# Altium schematic sheet bms_v2.SchDoc
size A4; SheetNumber: 1; SheetTotal: 1
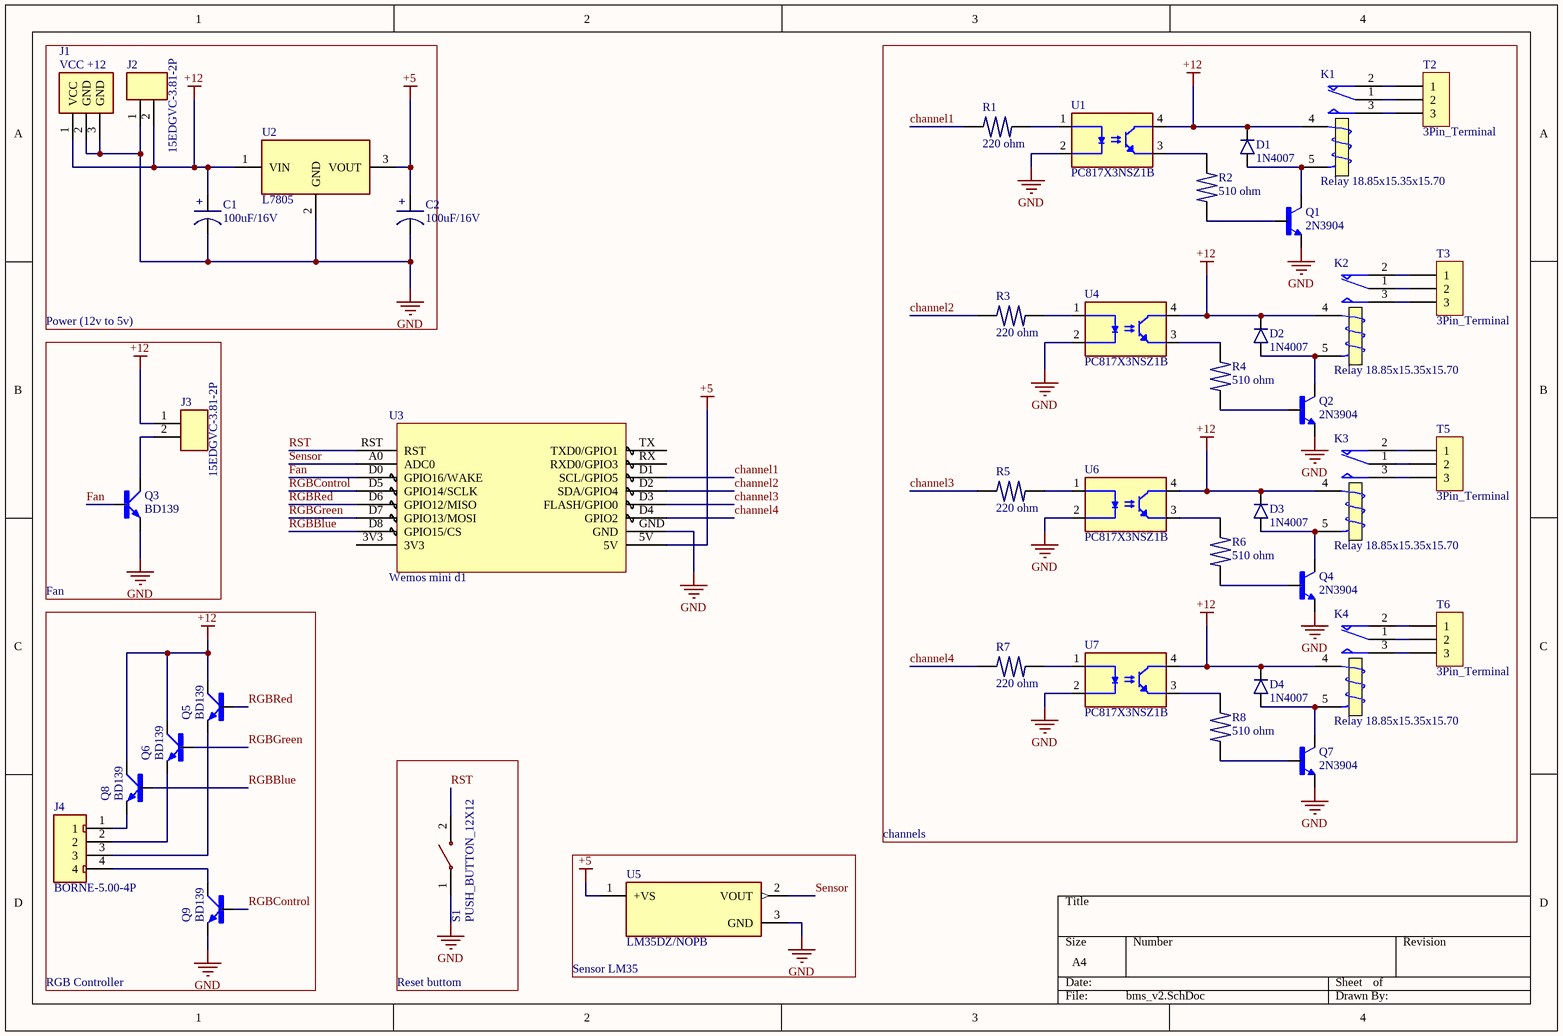
[diagram p0: bms_v2.SchDoc]

## Parts
C1  100uF/16V  [100uF/16V]
C2  100uF/16V  [100uF/16V]
D1  1N4007  [1N4007]
D2  1N4007  [1N4007]
D3  1N4007  [1N4007]
D4  1N4007  [1N4007]
J1  VCC +12  [JACK_P4]
J2  15EDGVC-3.81-2P  [15EDGVC-3.81-2P]
J3  15EDGVC-3.81-2P  [15EDGVC-3.81-2P]
J4  BORNE-5.00-4P  [BORNE-5.00-4P]
K1  Relay 18.85x15.35x15.70  [Relay 18.85x15.35x15.70]
K2  Relay 18.85x15.35x15.70  [Relay 18.85x15.35x15.70]
K3  Relay 18.85x15.35x15.70  [Relay 18.85x15.35x15.70]
K4  Relay 18.85x15.35x15.70  [Relay 18.85x15.35x15.70]
Q1  2N3904  [TO92127P495H495-3]
Q2  2N3904  [TO92127P495H495-3]
Q3  BD139  [TO126AV]
Q4  2N3904  [TO92127P495H495-3]
Q5  BD139  [TO126AV]
Q6  BD139  [TO126AV]
Q7  2N3904  [TO92127P495H495-3]
Q8  BD139  [TO126AV]
Q9  BD139  [TO126AV]
R1  220 ohm  [RESISTOR_PTH_10mm]
R2  510 ohm  [RESISTOR_PTH_10mm]
R3  220 ohm  [RESISTOR_PTH_10mm]
R4  510 ohm  [RESISTOR_PTH_10mm]
R5  220 ohm  [RESISTOR_PTH_10mm]
R6  510 ohm  [RESISTOR_PTH_10mm]
R7  220 ohm  [RESISTOR_PTH_10mm]
R8  510 ohm  [RESISTOR_PTH_10mm]
S1  PUSH_BUTTON_12X12  [PUSH_BUTTON_12X12_BLUE]
T2  3Pin_Terminal  [3Pin_Terminal]
T3  3Pin_Terminal  [3Pin_Terminal]
T5  3Pin_Terminal  [3Pin_Terminal]
T6  3Pin_Terminal  [3Pin_Terminal]
U1  PC817X3NSZ1B  [DIP762W50P254L495H455Q4]
U2  L7805  [L7805_180]
U3  Wemos mini d1  [PCBComponent_1]
U4  PC817X3NSZ1B  [DIP762W50P254L495H455Q4]
U5  LM35DZ/NOPB  [TO92127P521H735-3]
U6  PC817X3NSZ1B  [DIP762W50P254L495H455Q4]
U7  PC817X3NSZ1B  [DIP762W50P254L495H455Q4]

## Blocks framed on the sheet
Power (12v to 5v): C1 C2 J1 J2 U2
channels: D1-D4 K1-K4 Q1 Q2 Q4 Q7 R1-R8 T2 T3 T5 T6 U1 U4 U6 U7
Reset buttom: S1
Sensor LM35: U5

## Nets
+5: C2.2 U2.3(VOUT) U3.5V U5.1(+VS)
+12: C1.2 D1.2 D2.2 D3.2 D4.2 J1.1(VCC) J2.2 J3.1 K1.4(T1) K2.4(T1) K3.4(T1) K4.4(T1) Q5.C Q6.C Q8.C U1.4(COLLECTOR) U2.1(VIN) U4.4(COLLECTOR) U6.4(COLLECTOR) U7.4(COLLECTOR)
GND: C1.1 C2.1 J1.2(GND) J1.3(GND) J2.1 Q1.1(E) Q2.1(E) Q3.E Q4.1(E) Q7.1(E) Q9.E S1.1 U1.2(CATHODE) U2.2(GND) U3.GND U4.2(CATHODE) U5.3(GND) U6.2(CATHODE) U7.2(CATHODE)
channel1: R1.1 U3.D1(SCL/GPIO5)
channel2: R3.1 U3.D2(SDA/GPIO4)
channel3: R5.1 U3.D3(FLASH/GPIO0)
channel4: R7.1 U3.D4(GPIO2)
Fan: Q3.B U3.D0(GPIO16/WAKE)
RGBBlue: Q8.B U3.D8(GPIO15/CS)
RGBControl: Q9.B U3.D5(GPIO14/SCLK)
RGBGreen: Q6.B U3.D7(GPIO13/MOSI)
RGBRed: Q5.B U3.D6(GPIO12/MISO)
RST: S1.2 U3.RST
Sensor: U3.A0(ADC0) U5.2(VOUT)
NetD1_1: D1.1 K1.5(T2) Q1.3(C)
NetD2_1: D2.1 K2.5(T2) Q2.3(C)
NetD3_1: D3.1 K3.5(T2) Q4.3(C)
NetD4_1: D4.1 K4.5(T2) Q7.3(C)
NetJ3_2: J3.2 Q3.C
NetJ4_1: J4.1 Q8.E
NetJ4_2: J4.2 Q6.E
NetJ4_3: J4.3 Q5.E
NetJ4_4: J4.4 Q9.C
NetK1_1: K1.1(COM) T2.2
NetK1_2: K1.2(NC) T2.1
NetK1_3: K1.3(NO) T2.3
NetK2_1: K2.1(COM) T3.2
NetK2_2: K2.2(NC) T3.1
NetK2_3: K2.3(NO) T3.3
NetK3_1: K3.1(COM) T5.2
NetK3_2: K3.2(NC) T5.1
NetK3_3: K3.3(NO) T5.3
NetK4_1: K4.1(COM) T6.2
NetK4_2: K4.2(NC) T6.1
NetK4_3: K4.3(NO) T6.3
NetQ1_2: Q1.2(B) R2.2
NetQ2_2: Q2.2(B) R4.2
NetQ4_2: Q4.2(B) R6.2
NetQ7_2: Q7.2(B) R8.2
NetR1_2: R1.2 U1.1(ANODE)
NetR2_1: R2.1 U1.3(EMITTER)
NetR3_2: R3.2 U4.1(ANODE)
NetR4_1: R4.1 U4.3(EMITTER)
NetR5_2: R5.2 U6.1(ANODE)
NetR6_1: R6.1 U6.3(EMITTER)
NetR7_2: R7.2 U7.1(ANODE)
NetR8_1: R8.1 U7.3(EMITTER)

Not connected (* = marked no-connect by the designer): U3 3V3 RX(RXD0/GPIO3) TX(TXD0/GPIO1)

## Notes on the sheet
- Fan
- RGB Controller
- (in symbol 100uF/16V) +

## Library data of the parts
C1 C2 = 100uF/16V: Electrolytic Capacitor 100uF/16V
D1-D4 = 1N4007: Rectifier Diode 1000V 1A DO-41; Mouser PN: 637-1N4007; ComponentLink1Description: Datasheet; ComponentLink1URL: https://www.mouser.com/datasheet/2/849/1n4001-2577232.pdf; Digikey PN: 4617-1N4007TB-ND; JLCPCB PN: C3033995
J1 = JACK_P4: 9V Battery Connector Jack P4.
J2 J3 = 15EDGVC-3.81-2P: Female Connector 15EDGVC-2P, pitch 3.81mm.; JLCPCB PN: C8396
J4 = BORNE-5.00-4P: Borne 4 Vias, Pitch 5mm.; JLCPCB PN: C2915641
Q1 Q2 Q4 Q7 = 2N3904: TRANS NPN 40V 200MA TO92-3; MF: Rectron; SnapEDA_Link: https://www.snapeda.com/parts/2N3904/Rectron/view-part/?ref=snap; Package: TO-226-3 Rectron; MP: 2N3904; Check_prices: https://www.snapeda.com/parts/2N3904/Rectron/view-part/?ref=eda; Purchase-URL: https://pricing.snapeda.com/search/part/2N3904/?ref=eda; Price: None; Value: *; Availability: In Stock
Q3 Q5 Q6 Q8 Q9 = BD139: Bipolar (BJT) Transistor NPN 80 V 1.5 A - 1.25 W Through Hole TO-126-3; MF: ON; SnapEDA_Link: https://www.snapeda.com/parts/BD139/Onsemi/view-part/?ref=snap; Package: TO-126 STMicroelectronics; Value: *; MP: BD139; Check_prices: https://www.snapeda.com/parts/BD139/Onsemi/view-part/?ref=eda
R1-R8 = RESISTOR_10mm: Generic Resistor 10mm.
S1 = PUSH_BUTTON_12X12: Push Button Tactile Switch PTH 4 Pins 12x12mm.; Mouser PN: 992-BUTT-12-5; JLCPCB PN: C84931
U1 U4 U6 U7 = PC817X3NSZ1B: Optoisolator Transistor Output - 1 Channel 4-DIP; MF: Sharp Microelectronics; SnapEDA_Link: https://www.snapeda.com/parts/PC817X3NSZ1B/Sharp+Microelectronics/view-part/?ref=snap; Price: None; Purchase-URL: https://pricing.snapeda.com/search/part/PC817X3NSZ1B/?ref=eda; Check_prices: https://www.snapeda.com/parts/PC817X3NSZ1B/Sharp+Microelectronics/view-part/?ref=eda; MP: PC817X3NSZ1B; Value: *; Availability: In Stock; Package: DIP-4 Sharp Microelectronics
U2 = L7805: IC REG LINEAR 5V 1.5A TO220AB; ComponentLink1Description: Datasheet; ComponentLink1URL: https://www.mouser.com/datasheet/2/389/l78-1849632.pdf; Mouser PN: 511-L7805CV; Digikey PN: 497-1443-5-ND; JLCPCB PN PTH: C347289; JLCPCB PN SMD: C15077
U5 = LM35DZ/NOPB: Temperature Sensor Analog, Local 0Â°C ~ 100Â°C 10mV/Â°C TO-92-3; MP: LM35DZ; MF: Texas Instruments; Price: None; Availability: In Stock; Package: E-PKG AXIAL-LEADED-2 ON Semiconductor; Value: *; SnapEDA_Link: https://www.snapeda.com/parts/LM35DZ/Texas+Instruments/view-part/?ref=snap; Purchase-URL: https://pricing.snapeda.com/search/part/LM35DZ/?ref=eda; Check_prices: https://www.snapeda.com/parts/LM35DZ/Texas+Instruments/view-part/?ref=eda